# EAGLE schematic mugsy-cone-mech-pcb-schematic-eagle (EAGLE 9.7.0)
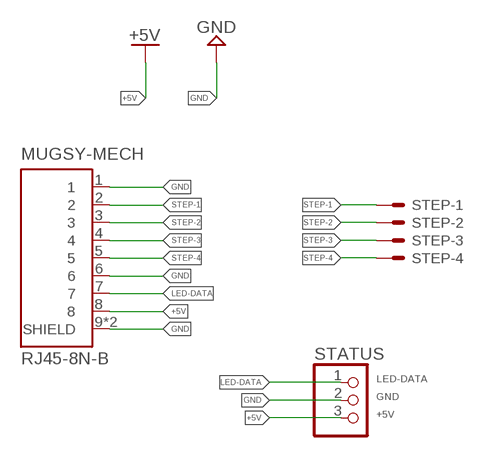
[diagram p0: schematic, sheet 1]

## Parts
MUGSY-MECH  RJ45-8N-B  [TE_RJ45-8N-B]
STATUS  PINHD-1X3CB  [1X03-CLEANBIG]
STEP  JST-XH-04-PIN-ROUND-PAD  [JST-XH-04-PACKAGE-ROUND-PAD]

## Nets
+5V: MUGSY-MECH.8 STATUS.3
GND: MUGSY-MECH.1 MUGSY-MECH.6 MUGSY-MECH.9(SHIELD) MUGSY-MECH.10(SHIELD) STATUS.2
LED-DATA: MUGSY-MECH.7 STATUS.1
STEP-1: MUGSY-MECH.2 STEP.1
STEP-2: MUGSY-MECH.3 STEP.2
STEP-3: MUGSY-MECH.4 STEP.3
STEP-4: MUGSY-MECH.5 STEP.4

## Library data of the parts
MUGSY-MECH = RJ45-8N-B:RJ45-8N-B: RJ Jack / Signal Line EMI/RFI Filters 6 TERM LOW PROFILE BLOCK INDUCTOR 8 PIN Check availability <https://pricing.snapeda.com/parts/RJ45-8N-B/TE%20Connectivity/view-part?ref=eda>; AVAILABILITY: In Stock; CHECK_PRICES: https://www.snapeda.com/parts/RJ45-8N-B/TE+Connectivity+Corcom+Filters/view-part/?ref=eda; DESCRIPTION: Corcom FILTER SIGNAL LINE MODULAR 8CONTACTS 1 PORT THROUGH HOLE | TE Connectivity RJ45-8N-B; MF: TE Connectivity; MP: RJ45-8N-B; PACKAGE: None; PRICE: None; PURCHASE-URL: https://www.snapeda.com/api/url_track_click_mouser/?unipart_id=49386&manufacturer=TE Connectivity&part_name=RJ45-8N-B&search_term=None; SNAPEDA_LINK: https://www.snapeda.com/parts/RJ45-8N-B/TE+Connectivity+Corcom+Filters/view-part/?ref=snap
STATUS = adafruit:PINHD-1X3: PIN HEADER
STEP = Rembrandt Electronics - JST XH Connectors v1-0:JST-XH-04-PIN: JST XH Connector 2 Pin Wire to board connector. Pitch: 2,54 mm, (0.100") Number of pins: 4 Created by Rembrandt Electronics www.rembrandtelectronics.com